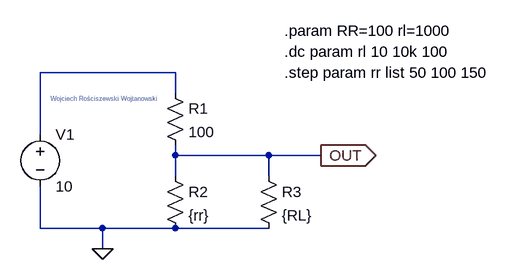
[diagram p0: schematic Analysis of the voltage divider circuit with load.asc]
Analysis of the voltage divider circuit with load.asc, the LTspice schematic file:
Version 4
SHEET 1 880 680
WIRE -384 -208 -592 -208
WIRE -384 -176 -384 -208
WIRE -592 -112 -592 -208
WIRE -384 -80 -384 -96
WIRE -240 -80 -384 -80
WIRE -160 -80 -240 -80
WIRE -384 -48 -384 -80
WIRE -240 -48 -240 -80
WIRE -592 32 -592 -32
WIRE -496 32 -592 32
WIRE -384 32 -496 32
WIRE -240 32 -384 32
WIRE -496 64 -496 32
FLAG -496 64 0
FLAG -160 -80 OUT
IOPIN -160 -80 Out
SYMBOL res -400 -192 R0
SYMATTR InstName R1
SYMATTR Value 100
SYMBOL res -400 -64 R0
SYMATTR InstName R2
SYMATTR Value {rr}
SYMBOL voltage -592 -128 R0
WINDOW 123 0 0 Left 0
WINDOW 39 0 0 Left 0
SYMATTR InstName V1
SYMATTR Value 10
SYMBOL res -256 -64 R0
SYMATTR InstName R3
SYMATTR Value {RL}
TEXT -216 -240 Left 2 !.dc param rl 10 10k 100
TEXT -216 -272 Left 2 !.param RR=100 rl=1000
TEXT -216 -208 Left 2 !.step param rr list 50 100 150
TEXT -576 -168 Left 0 ;Wojciech Rościszewski Wojtanowski

The netlist it stands for:
* Analysis of the voltage divider circuit with load.asc
R1 N001 OUT 100
R2 OUT 0 {rr}
V1 N001 0 10
R3 OUT 0 {RL}
.dc param rl 10 10k 100
.param RR=100 rl=1000
.step param rr list 50 100 150
* Wojciech Rościszewski Wojtanowski
.backanno
.end